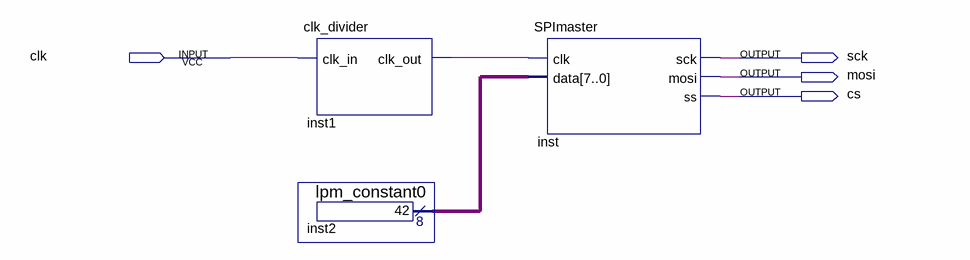
[diagram p0: schematic sheet]
// Quartus schematic Lab_1.bdf as structural Verilog: 3 symbols, 4 pins
module Lab_1 (
  input  clk,
  output sck,
  output mosi,
  output cs
);

  wire inst1_clk_out;
  wire [7:0] inst2_result;

  clk_divider inst1 (.clk_in(clk), .clk_out(inst1_clk_out));
  lpm_constant0 inst2 (.result(inst2_result));
  SPImaster inst (.clk(inst1_clk_out), .data(inst2_result), .sck(sck), .mosi(mosi), .ss(cs));
endmodule
